# EAGLE design PickupDriverV3.3 (EAGLE 6.1)
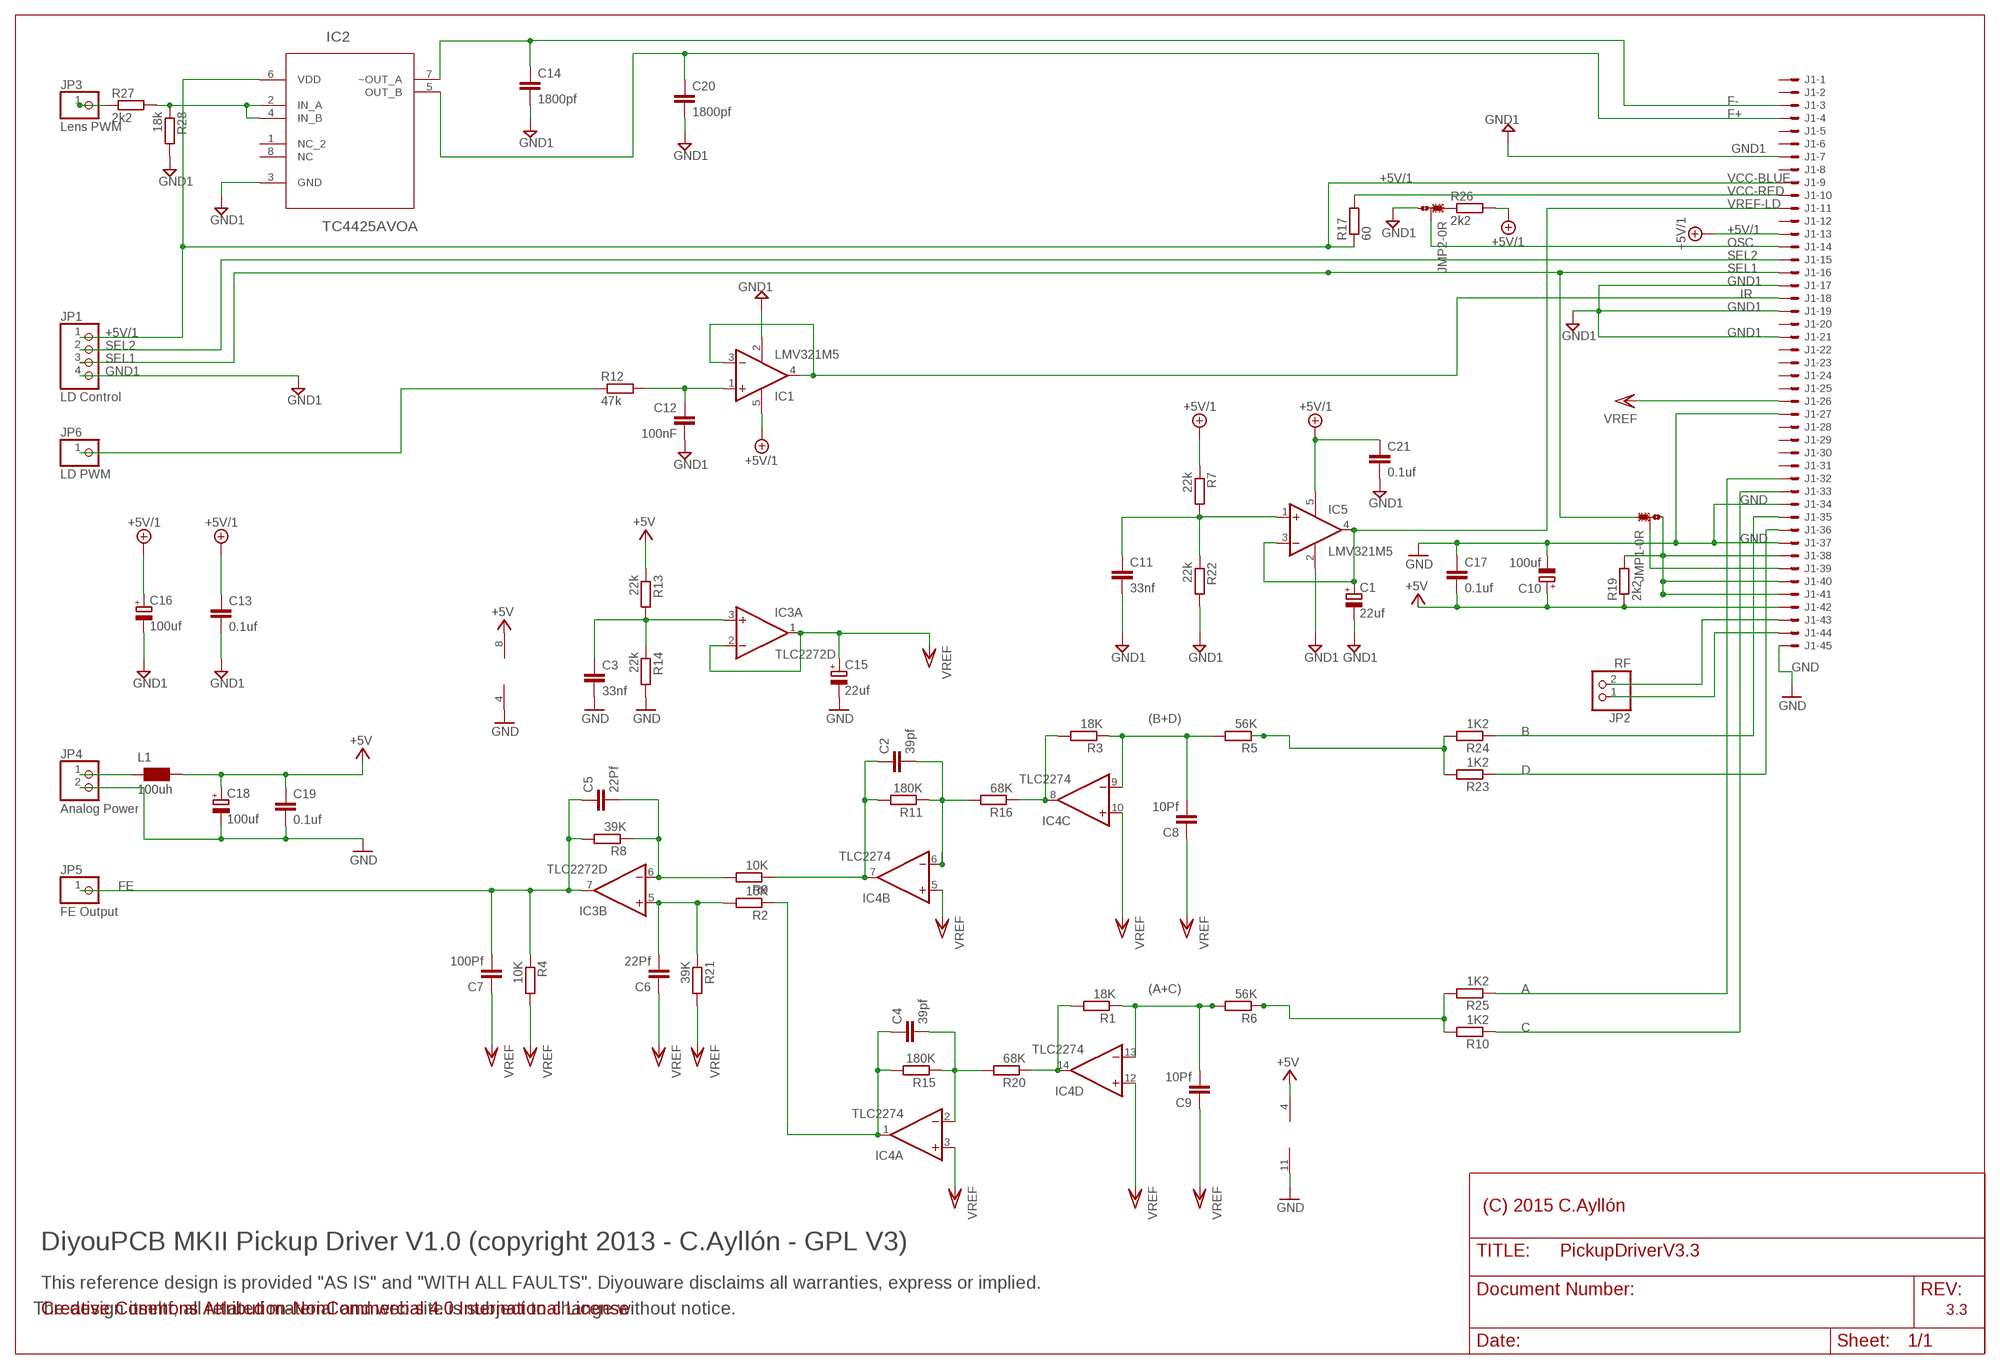
[diagram p0: schematic, sheet 1]

## Parts
C1  22uf  CPOL-EUSMCC  [SMC_C]
C2  39pf  C-EUC1206K  [C1206K]
C3  33nf  C-EUC1206K  [C1206K]
C4  39pf  C-EUC1206K  [C1206K]
C5  22Pf  C-EUC1206K  [C1206K]
C6  22Pf  C-EUC1206K  [C1206K]
C7  100Pf  C-EUC1206K  [C1206K]
C8  10Pf  C-EUC1206K  [C1206K]
C9  10Pf  C-EUC1206K  [C1206K]
C10  100uf  CPOL-EUSMCC  [SMC_C]
C11  33nf  C-EUC1206K  [C1206K]
C12  100nF  C-EUC1206K  [C1206K]
C13  0.1uf  C-EUC1206K  [C1206K]
C14  1800pf  C-EUC1206K  [C1206K]
C15  22uf  CPOL-EUSMCC  [SMC_C]
C16  100uf  CPOL-EUSMCC  [SMC_C]
C17  0.1uf  C-EUC1206K  [C1206K]
C18  100uf  CPOL-EUSMCC  [SMC_C]
C19  0.1uf  C-EUC1206K  [C1206K]
C20  1800pf  C-EUC1206K  [C1206K]
C21  0.1uf  C-EUC1206K  [C1206K]
IC1  LMV321M5  [SOT23-5]
IC2  TC4425AVOA  [SOIC127P600X175-8N]
IC3  TLC2272D  [SO08]
IC4  TLC2274  TLC274D  [SO14]
IC5  LMV321M5  [SOT23-5]
J1  XF2H-4515-1LW  [XF2H-4515-1LW]
JMP1  0R-JUMPA  [A0R-JMP]
JMP2  0R-JUMPA  [A0R-JMP]
JP1  LD Control  PINHD-1X4  [1X04]
JP2  RF  PINHD-1X2  [1X02]
JP3  Lens PWM  PINHD-1X1  [1X01]
JP4  Analog Power  PINHD-1X2  [1X02]
JP5  FE Output  PINHD-1X1  [1X01]
JP6  LD PWM  PINHD-1X1  [1X01]
L1  100uh  CHOKE-100UH  [CHOKE-100UH-1]
R1  18K  R-EU_R1206  [R1206]
R2  10K  R-EU_R1206  [R1206]
R3  18K  R-EU_R1206  [R1206]
R4  10K  R-EU_R1206  [R1206]
R5  56K  R-EU_R1206  [R1206]
R6  56K  R-EU_R1206  [R1206]
R7  22k  R-EU_R1206  [R1206]
R8  39K  R-EU_R1206  [R1206]
R9  10K  R-EU_R1206  [R1206]
R10  1K2  R-EU_R1206  [R1206]
R11  180K  R-EU_R1206  [R1206]
R12  47k  R-EU_R1206  [R1206]
R13  22k  R-EU_R1206  [R1206]
R14  22k  R-EU_R1206  [R1206]
R15  180K  R-EU_R1206  [R1206]
R16  68K  R-EU_R1206  [R1206]
R17  60  R-EU_R1206  [R1206]
R19  2k2  R-EU_R1206  [R1206]
R20  68K  R-EU_R1206  [R1206]
R21  39K  R-EU_R1206  [R1206]
R22  22k  R-EU_R1206  [R1206]
R23  1K2  R-EU_R1206  [R1206]
R24  1K2  R-EU_R1206  [R1206]
R25  1K2  R-EU_R1206  [R1206]
R26  2k2  R-EU_R1206  [R1206]
R27  2k2  R-EU_R1206  [R1206]
R28  18k  R-EU_R1206  [R1206]

## Nets
+5V [supply1]: C10.+ C17.2 C18.+ C19.1 IC3.8(P:V+) IC4.4(P:V+) J1.42 L1.2 R13.1 R19.1
+5V/1 [supply2]: C13.1 C16.+ C21.1 IC1.5(V+) IC2.6(VDD) IC5.5(V+) J1.9 J1.13 JP1.1 R7.1 R17.1 R26.2
A: J1.32 R25.1
B: J1.35 R24.1
C: J1.33 R10.1
D: J1.36 R23.1
F+ [foco]: C20.1 IC2.5(OUT_B) J1.4
F- [foco]: C14.1 IC2.7(~OUT_A) J1.3
FE: C5.1 C7.2 IC3.7(B:OUT) JP5.1 R4.1 R8.2
FOCUS: IC2.2(IN_A) IC2.4(IN_B) R27.2 R28.1
GND [gnd]: C3.2 C10.- C15.- C17.1 C18.- C19.2 IC3.4(P:V-) IC4.11(P:V-) J1.27 J1.34 J1.37 J1.45 JP4.2 R14.2
GND1 [gnd1]: C1.- C11.2 C12.2 C13.2 C14.2 C16.- C20.2 C21.2 IC1.2(V-) IC2.3(GND) IC5.2(V-) J1.7 J1.17 J1.19 J1.21 JMP2.3 JP1.4 R22.2 R28.2
IR: IC1.3(-IN) IC1.4(OUT) J1.18
LASER_CURR: JP6.1 R12.1
LENS: JP3.1 R27.1
N$1: C11.1 IC5.1(+IN) R7.2 R22.1
N$2: C2.1 IC4.7(B:OUT) R9.1 R11.2
N$3: C12.1 IC1.1(+IN) R12.2
N$4: C8.2 IC4.9(C:-IN) R3.1 R5.2
N$5: IC4.14(D:OUT) R1.2 R20.1
N$6: C3.1 IC3.3(A:+IN) R13.2 R14.1
N$7: IC4.8(C:OUT) R3.2 R16.1
N$8: C9.2 IC4.13(D:-IN) R1.1 R6.2
N$9: C2.2 IC4.6(B:-IN) R11.1 R16.2
N$10: C5.2 IC3.6(B:-IN) R8.1 R9.2
N$11: C6.2 IC3.5(B:+IN) R2.2 R21.1
N$12 [supply1]: JP4.1 L1.1
N$13: JMP2.1 R26.1
N$14: C4.1 IC4.1(A:OUT) R2.1 R15.2
N$15: C4.2 IC4.2(A:-IN) R15.1 R20.2
N$16: R6.1 R10.2 R25.2
N$19: J1.43 JP2.2
N$20: J1.44 JP2.1
N$22: R5.1 R23.2 R24.2
ND: J1.38 J1.40 J1.41 JMP1.3 R19.2
OSC: J1.14 JMP2.2
REDVCC [supply2]: J1.10 R17.2
SEL1: J1.16 JMP1.1 JP1.3
SEL2: J1.15 JP1.2
SW: J1.39 JMP1.2
VREF: C6.1 C7.1 C8.1 C9.1 C15.+ IC3.1(A:OUT) IC3.2(A:-IN) IC4.3(A:+IN) IC4.5(B:+IN) IC4.10(C:+IN) IC4.12(D:+IN) J1.26 R4.2 R21.2
VREF-LD: C1.+ IC5.3(-IN) IC5.4(OUT) J1.11
Unconnected: IC2.1(NC_2) IC2.8(NC) J1.1 J1.2 J1.5 J1.6 J1.8 J1.12 J1.20 J1.22 J1.23 J1.24 J1.25 J1.28 J1.29 J1.30 J1.31

## Notes on the sheet
- VCC-BLUE
- VCC-RED
- (B+D)
- (A+C)
- (C) 2015 C.Ayllón
- DiyouPCB MKII Pickup Driver V1.0 (copyright 2013 - C.Ayllón - GPL V3)
- This reference design is provided "AS IS" and "WITH ALL FAULTS". Diyouware disclaims all warranties, express or implied.
- The design itseltf, all related material and web site is subject to change without notice. | Creative Commons Attribution-NonCommercial 4.0 International License | 3.3

## Library data of the parts
C1 C10 C15 C16 C18 = rcl:CPOL-EU: POLARIZED CAPACITOR, European symbol
C2 C4-C9 C12 C14 C20 = rcl:C-EU: CAPACITOR, European symbol
C3 C11 C13 C17 C19 C21 = resistor:C-EU: CAPACITOR, European symbol
IC1 IC5 = linear:LMV321?*: General Purpose, Low Voltage, Rail-to-Rail Output Operational Amplifiers Source: http://www.national.com/mpf/LM/LMV321.html http://www.national.com/dt/lmv_qual.pdf
IC2 = Microchip_By_element14_Batch_1:TC4425AVOA: Dual High-Speed Power MOSFET Drivers; DESCRIPTION: MOSFET; MPN: TC4425AVOA; OC_FARNELL: 1834904; OC_NEWARK: 56K7426; PACKAGE: SOIC-8; SUPPLIER: Microchip
IC3 = linear:TLC2272: OP AMP
IC4 = linear:TLC274: OP AMP
J1 = con-omron:XF2*-45?: OMRON FPC Connector Source : http://www.omron.com/ecb/products/pdf/fpc.pdf; OC_FARNELL: unknown; OC_NEWARK: unknown
JMP1 JMP2 = jump-0r-smd:0R-JUMP: SMD 0R 0805 Jumper
JP1 = pinhead:PINHD-1X4: PIN HEADER
JP2 JP4 = pinhead:PINHD-1X2: PIN HEADER
JP3 JP5 JP6 = pinhead:PINHD-1X1: PIN HEADER
L1 = wurth_electronics_midcom_inc_v1-0:CHOKE-100UH
R1-R17 R19-R28 = rcl:R-EU_: RESISTOR, European symbol

## Net classes
0 default: width 0.254 mm, drill 0.305 mm, clearance 0.127 mm
1 supply1: width 0.381 mm, drill 0.305 mm, clearance 0.127 mm
2 gnd: width 0.381 mm, drill 0.305 mm, clearance 0.127 mm
3 supply2: width 0.432 mm, drill 0.305 mm, clearance 0.127 mm
4 foco: width 0.432 mm, drill 0.305 mm, clearance 0.127 mm
5 gnd1: width 0.381 mm, drill 0.305 mm, clearance 0.127 mm

## Board
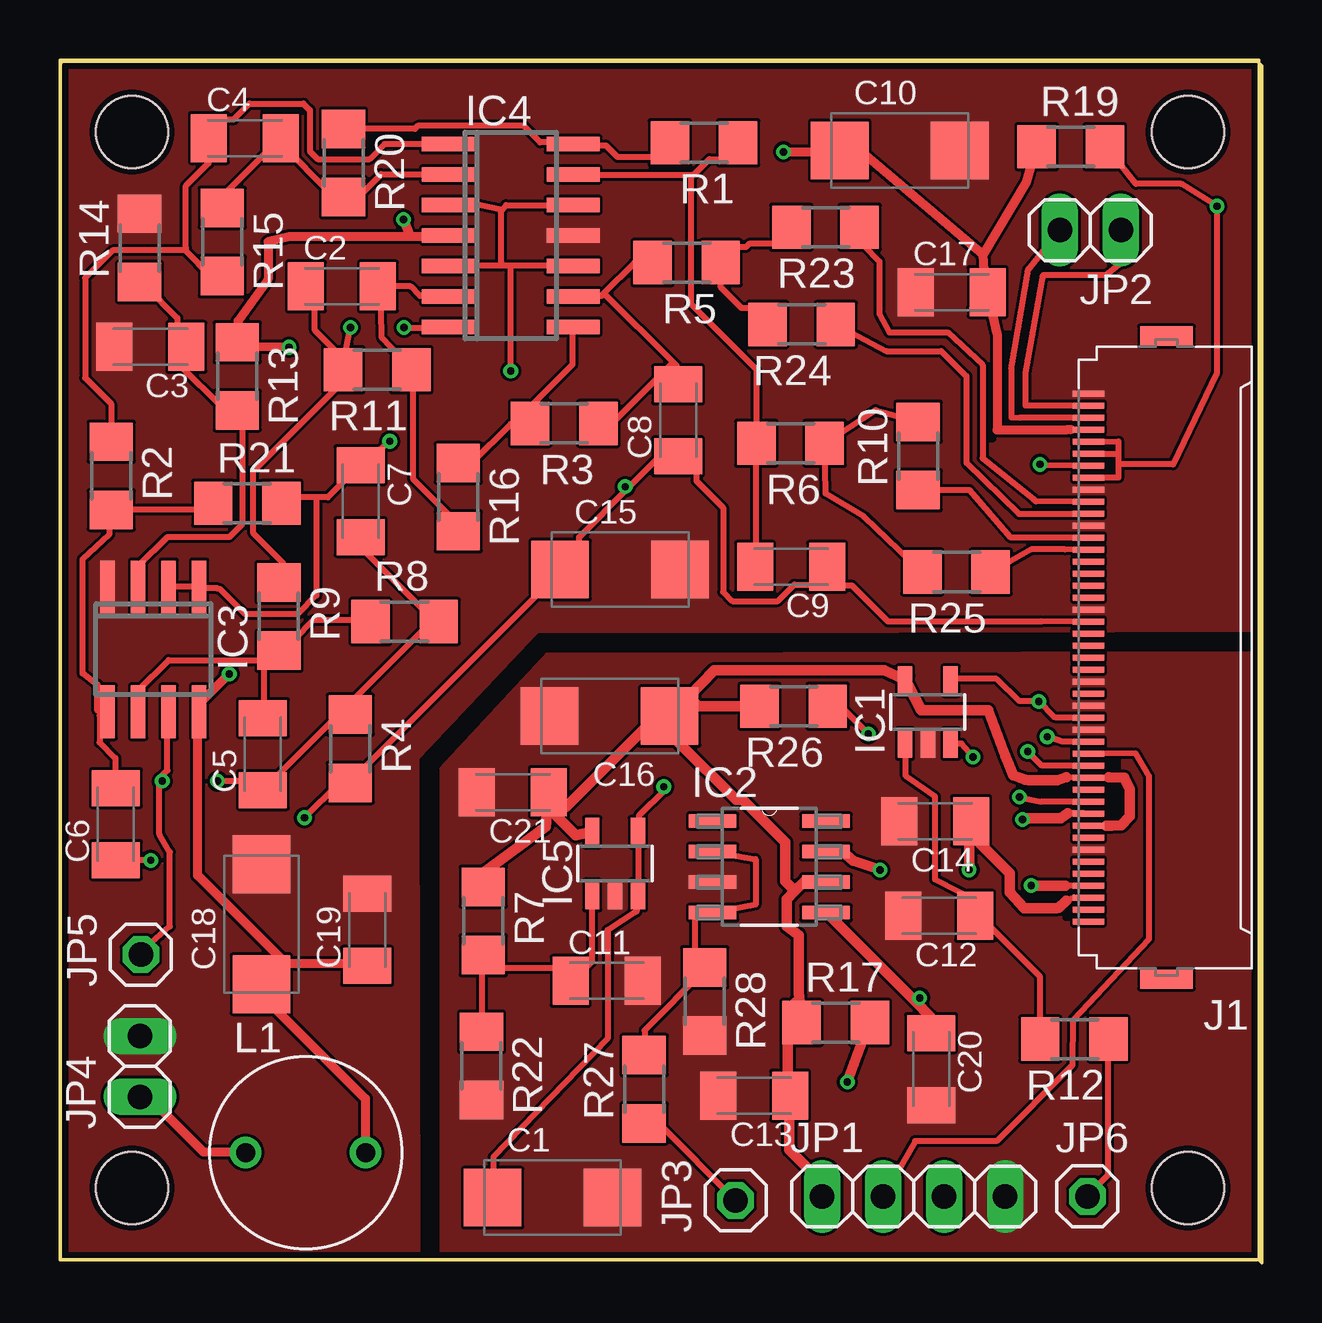
[diagram p1: board, top side]
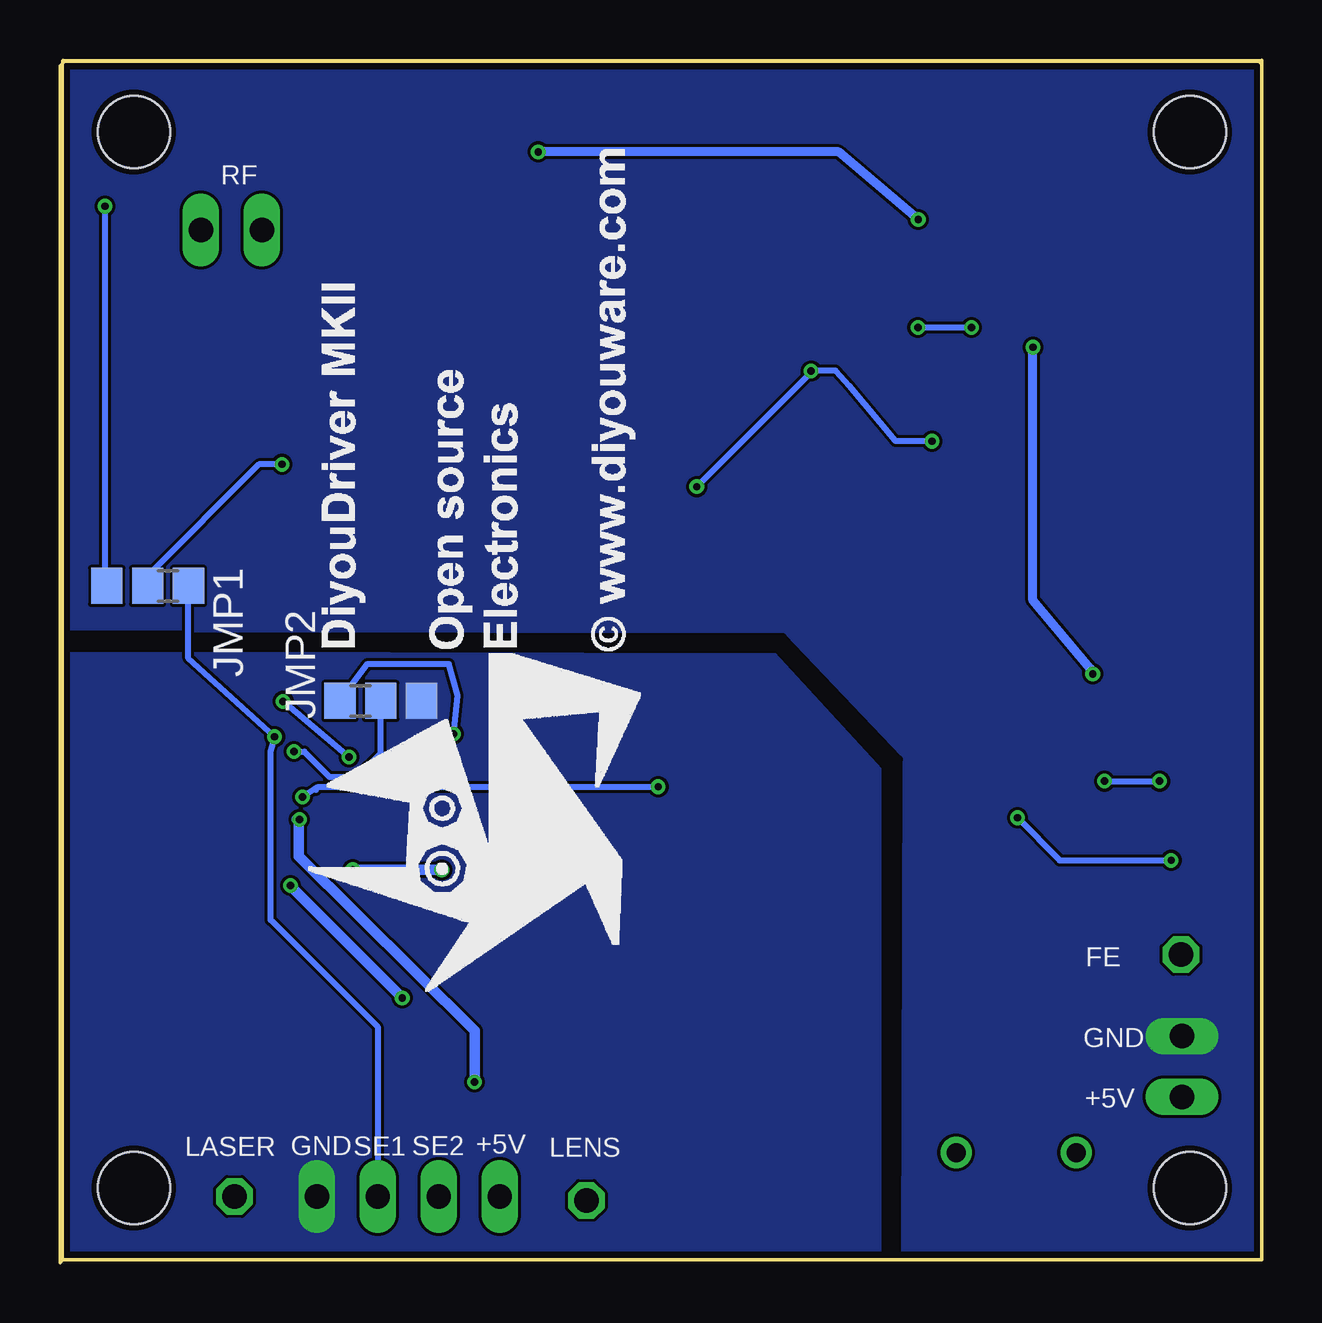
[diagram p2: board, bottom side, seen from below]

Size 50.08 x 50.12 mm. Coordinates in mm from the lower left corner, seen from the top.
Outline: 49.97,0.13 49.96,50.12 0,50.11 0,0.12
Outline: 0,0.12 49.95,0.12
Outline: 0,50.12 0,49.94
Outline: 0,49.94 0,0.12
Outline: 0,0.12 49.96,0.12 50.08,0 50.08,49.87 49.89,50.06 0.12,50.06 0,49.94
Copper layers (1*16): Top 0.035mm / dielectric 1.5mm / Bottom 0.035mm
Design rules "default": minimum track width 5mil, minimum drill 12mil, track to track 5mil, track to pad 5mil, pad to pad 5mil, via to via 5mil, smd to smd 0mil, copper to edge 10mil, drill to drill 10mil, minimum pad ring 10mil, minimum via ring 6mil, stop-mask expansion 2mil, vias tented up to drill 25mil, thermal gap 10mil
Holes 3 mm at 3,47.12 47,47.12 3,3.12 47,3.12
tRestrict: area 15.1,0.1 to 50,26.1; area 43.6,20.5 to 44.1,21; area 38.7,34.3 to 38.9,34.5; area 39.3,37.8 to 39.6,38.7; area 41.9,14.4 to 42.1,14.7
bRestrict: area 15.1,0.1 to 44.4,26.1; area 45,25.6 to 49.7,25.8; area 45,26.1 to 49.7,26.2
vRestrict: area 41.2,13.1 to 42.6,37.7; area 28.4,14.3 to 30.8,18.6; area 21.6,15.8 to 24.6,17.3; area 34.6,22.3 to 37.8,23.6; area 17.6,38.8 to 20.3,47.1; area 1.3,23.9 to 5.8,26.8; area 43.2,14.2 to 49.5,39.9

### Footprints (pad centres in the part's own frame; a part is rotated, then mirrored left to right if it is on the bottom)
SMC_C = smd 2.4 x 2.4: + -2.5,0; - 2.5,0
C1206K = smd 1.5 x 2: 1 -1.5,0; 2 1.5,0
SOT23-5 = smd 0.6 x 1.2: 1 -0.95,-1.306; 2 0,-1.306; 3 0.95,-1.306; 4 0.95,1.306; 5 -0.95,1.306
SOIC127P600X175-8N = smd 1.981 x 0.559: 1 -2.362,1.905; 2 -2.362,0.635; 3 -2.362,-0.635; 4 -2.362,-1.905; 5 2.362,-1.905; 6 2.362,-0.635; 7 2.362,0.635; 8 2.362,1.905
SO08 = smd 0.6 x 2.2: 1 -1.905,-2.6; 2 -0.635,-2.6; 3 0.635,-2.6; 4 1.905,-2.6; 5 1.905,2.6; 6 0.635,2.6; 7 -0.635,2.6; 8 -1.905,2.6
SO14 = smd 0.6 x 2.2: 1 -3.81,-2.6; 2 -2.54,-2.6; 3 -1.27,-2.6; 4 0,-2.6; 5 1.27,-2.6; 6 2.54,-2.6; 7 3.81,-2.6; 8 3.81,2.6; 9 2.54,2.6; 10 1.27,2.6; 11 0,2.6; 12 -1.27,2.6; 13 -2.54,2.6; 14 -3.81,2.6
XF2H-4515-1LW = smd 1.3 x 0.25: 1 3.175,11; 2 3.175,10.5; 3 3.175,10; 4 3.175,9.5; 5 3.175,9; 6 3.175,8.5; 7 3.175,8; 8 3.175,7.5; 9 3.175,7; 10 3.175,6.5; 11 3.175,6; 12 3.175,5.5; 13 3.175,5; 14 3.175,4.5; 15 3.175,4; 16 3.175,3.5; 17 3.175,3; 18 3.175,2.5; 19 3.175,2; 20 3.175,1.5; 21 3.175,1; 22 3.175,0.5; 23 3.175,0; 24 3.175,-0.5; 25 3.175,-1; 26 3.175,-1.5; 27 3.175,-2; 28 3.175,-2.5; 29 3.175,-3; 30 3.175,-3.5; 31 3.175,-4; 32 3.175,-4.5; 33 3.175,-5; 34 3.175,-5.5; 35 3.175,-6; 36 3.175,-6.5; 37 3.175,-7; 38 3.175,-7.5; 39 3.175,-8; 40 3.175,-8.5; 41 3.175,-9; 42 3.175,-9.5; 43 3.175,-10; 44 3.175,-10.5; 45 3.175,-11 | smd 2.2 x 0.8: M1 -0.075,13.4; M2 -0.075,-13.4
A0R-JMP = smd 1.5 x 1.3: 1 0,1.7; 2 0,0; 3 0,-1.7
1X04 = drill 1.016 long: 1 -3.81,0; 2 -1.27,0; 3 1.27,0; 4 3.81,0
1X02 = drill 1.016 long: 1 -1.27,0; 2 1.27,0
1X01 = drill 1.016 octagon: 1 0,0
CHOKE-100UH-1 = drill 0.8: 1 -2.5,0; 2 2.5,0
R1206 = smd 1.6 x 1.803: 1 -1.422,0; 2 1.422,0

### Placement (x,y rotation side)
C1  20.52,2.72 0 top
C2  11.75,40.69 0 top
C3  3.77,38.17 180 top
C4  7.71,46.87 0 top
C5  8.46,21.19 90 top
C6  2.33,18.28 90 top
C7  12.53,31.73 270 top
C8  25.76,35.11 90 top
C9  30.46,29 180 top
C10  34.99,46.35 0 top
C11  22.78,11.75 0 top
C12  36.63,14.45 180 top
C13  28.93,6.97 180 top
C14  36.46,18.4 180 top
C15  23.34,28.88 0 top
C16  22.9,22.78 180 top
C17  37.15,40.45 0 top
C18  8.39,14.11 90 top
C19  12.8,13.87 90 top
C20  36.3,8.08 270 top
C21  18.87,19.61 180 top
IC1  36.16,22.95 0 top
IC2  29.55,16.5 0 top
IC3  3.89,25.56 180 top
IC4  18.78,42.81 270 top
IC5  23.13,16.64 0 top
J1  46.03,25.22 180 top
JMP1  46.43,28.2 270 bottom
JMP2  36.71,23.42 90 bottom
JP1  35.57,2.77 0 top
JP2  42.94,43.03 180 top
JP3  28.15,2.6 90 top
JP4  3.33,8.18 90 top
JP5  3.37,12.84 90 top
JP6  42.81,2.77 0 top
L1  10.24,4.59 0 top
R1  26.84,46.67 180 top
R2  2.14,32.79 270 top
R3  21.01,34.98 180 top
R4  12.09,21.42 270 top
R5  26.11,41.68 180 top
R6  30.43,34.15 180 top
R7  17.63,14.24 270 top
R8  14.36,26.72 0 top
R9  9.12,26.93 270 top
R10  35.76,33.62 90 top
R11  13.22,37.21 180 top
R12  42.27,9.33 180 top
R13  7.38,36.94 270 top
R14  3.32,42.29 90 top
R15  6.76,42.54 270 top
R16  16.59,31.9 270 top
R17  32.33,10.01 0 top
R19  42.11,46.5 0 top
R20  11.81,45.83 270 top
R21  7.81,31.65 0 top
R22  17.56,8.21 270 top
R23  31.9,43.15 180 top
R24  30.9,39.1 180 top
R25  37.35,28.79 180 top
R26  30.57,23.2 180 top
R27  24.34,7.23 90 top
R28  26.86,10.89 270 top

### Tracks (layer width: path | path; a pad name or v marks a point on that pad's centre or on a via)
+5V  (via drill 0.3)
  Top 0.254: 41.94,34.72 42.12,34.72 J1.42
  Top 0.381: 38.07,39.75 38.55,40.44 C17.2 | 38.47,42.01 33.33,46.35 32.52,46.35 C10.+ 32.31,46.29 v30.15,46.29 | 38.47,42.01 38.55,40.62 C17.2 | 38.59,40.41 C17.2 | 38.47,42.01 40.27,45.05 R19.1 | C17.2 39.05,38.72 39.05,34.7 40.86,34.71 40.87,34.71 41.92,34.7 42.09,34.72 42.12,34.72 | 14.57,42.76 15.68,42.76 16.17,42.78 IC4.4 | 14.57,42.76 9.56,42.76 8.67,42.54 8.67,40.98 7.41,39.24 7.41,38.37 R13.1 7.38,38.16 v9.54,38.15 | C19.1 13.35,12.48 9.27,12.48 C18.+ | v14.32,43.48 14.57,42.76 | L1.2 12.72,4.62 12.72,6.84 8.49,11.07 8.49,11.43 C18.+ | v7.05,24.54 5.82,23.31 5.82,22.98 IC3.8 5.73,22.8 5.73,16.14 9.21,12.66 C18.+
  Bottom 0.381: v30.15,46.29 17.64,46.29 v14.32,43.48 | v9.54,38.15 9.54,27.61 7.15,24.76 7.08,24.57 v7.05,24.54
+5V/1
  Top 0.254: 43.69,20.23 J1.13 41.94,20.23 | J1.9 43.59,18.22 43.83,18.22
  Top 0.432: 30.61,15.5 31.03,15.91 31.71,15.87 IC2.6 | 30.61,15.5 30.28,15.16 30.28,14.03 30.78,13.65 30.78,11.28 R17.1 30.66,10.86 30.33,10.53 30.33,6.99 C13.1 30.39,6.75 30.39,4.71 31.74,3.36 31.74,2.79 JP1.1 | 43.69,20.23 44.34,20.22 44.58,19.74 44.58,18.6 44.22,18.23 43.8,18.21 43.59,18.21 43.59,18.22 | 41.94,20.23 41.55,20.11 40.45,20.11 | 40.45,20.11 40.36,20.11 | 40.45,20.11 40.22,20.12 39.73,20.31 39.39,21.12 38.67,23.02 35.88,23.02 35.34,24.06 IC1.5 35.3,24.46 35.15,24.31 34.35,24.68 27.25,24.68 26.19,23.59 | 25.59,21.87 C16.+ | 20.59,18.72 20.25,19.59 C21.1 20.23,18.17 17.64,16.26 17.64,15.69 R7.1 | 20.59,18.72 21.49,17.82 22.17,17.97 IC5.5 | 20.59,18.72 21.12,19.02 24.81,22.71 C16.+ | 30.61,15.5 30.21,15.9 30.21,17.52 28.44,19.29 28.17,19.29 25.74,21.72 C16.+ | 26.19,23.59 C16.+ | R26.2 26.59,23.2 26.19,23.59
A
  Top 0.254: J1.32 41.87,29.73 40.46,29.73 38.81,28.77 | 38.81,28.77 38.75,28.73 | R25.1 38.79,28.8 38.81,28.77
B
  Top 0.254: R24.1 34.43,37.99 36.72,37.99 37.77,36.95 37.77,33.33 39.95,31.21 J1.35
C
  Top 0.254: J1.33 39.62,30.22 37.9,32.2 35.88,32.19 R10.1
D
  Top 0.254: J1.36 40.66,31.72 40.57,31.81 38.44,33.53 38.44,37.41 36.98,38.77 34.56,38.77 34.14,39.54 34.14,41.73 33.48,42.39 33.36,42.39 33.33,42.42 R23.1
F+  (via drill 0.3)
  Top 0.254: J1.4 41.88,15.72
  Top 0.432: v40.47,15.72 | 41.88,15.72 v40.47,15.72 | v40.47,15.72 | 35.64,10.89 31.92,14.61 IC2.5 | 35.64,10.89 36.27,10.26 36.27,9.48 C20.1 | v35.82,11.04 35.79,11.04 35.64,10.89
  Bottom 0.432: v35.82,11.04 40.47,15.69 v40.47,15.72
F-  (via drill 0.3)
  Top 0.254: J1.3 42.26,15.22 41.92,15.09 | 41.52,14.78 41.62,14.8
  Top 0.432: 41.62,14.8 41.92,15.09 | 41.52,14.78 40.17,14.78 39.57,15.45 39.57,16.23 37.89,17.91 37.89,18.39 C14.1 37.89,17.76 v37.88,16.38 | IC2.7 32.64,17.11 33.05,16.75 v34.17,16.37
  Bottom 0.432: v34.17,16.37 37.1,16.37 v37.88,16.38
FE  (via drill 0.3)
  Top 0.254: 3.54,13.17 JP5.1 3.63,13.2 4.58,14.02 4.58,17.11 4.14,17.86 4.14,20.07 v4.26,20.07 4.14,20.19 4.47,20.52 4.47,22.83 IC3.7 | R4.1 | C7.2 12.54,30.21 12.54,29.82 15.54,26.82 R8.2 15.48,26.73 11.7,22.95 R4.1 | C5.1 8.46,19.71 11.61,22.86 R4.1 | 8.34,19.74 C5.1 | v6.56,20.07 8.67,20.07 C5.1
  Bottom 0.254: v6.56,20.07 v4.26,20.07
FOCUS
  Top 0.254: IC2.2 28.98,16.82 28.98,14.93 27.27,14.58 | 27.27,14.58 27.24,14.57 | 27.27,14.58 27.24,14.7 IC2.4 26.49,14.58 26.46,14.55 26.46,12.45 R28.1 26.85,12.18 24.36,9.69 24.36,8.67 R27.2
GND
  pour Top (isolate 0.127, no thermals): 0,0.12 0.01,50.1 49.95,50.11 49.92,26.33 19.91,26.23 14.97,21.02 15.05,0.15
  pour Bottom (isolate 0.127, no thermals): 0,0.12 0.01,50.08 49.96,50.09 49.92,26.33 19.91,26.23 14.97,21.02 15.05,0.15
GND1
  pour Top (isolate 0.127, no thermals): 15.78,0.12 15.81,20.58 20.29,25.42 49.97,25.55 49.99,0.14
  pour Bottom (isolate 0.127, no thermals): 15.79,0.13 15.8,20.58 20.29,25.42 49.97,25.53 49.95,0.12
IR  (via drill 0.3)
  Top 0.254: IC1.4 37.11,24.27 37.16,24.3 37.19,24.33 39.03,24.33 39.99,23.41 40.77,23.41 | J1.18 42.18,22.72 41.5,22.72 41.42,22.74 40.79,23.41 40.77,23.41 | v38.04,21.08 37.56,21.63 IC1.3 | 40.77,23.41 v40.77,23.4 v40.78,23.4
  Bottom 0.254: v38.04,21.08 v40.78,23.4 v40.78,23.38 40.79,23.38
LASER_CURR
  Top 0.254: R12.1 43.68,9.3 43.68,3.66 42.81,2.79 JP6.1
LENS
  Top 0.254: R27.1 24.36,5.79 24.96,5.79 JP3.1
N$1
  Top 0.254: R22.1 17.58,9.63 17.58,12.78 17.61,12.81 R7.2 17.7,12.27 21.72,12.27 C11.1 21.36,11.76 22.17,12.57 22.17,15.3 IC5.1
N$2  (via drill 0.3)
  Top 0.254: R9.1 9.34,28.81 9.27,29.04 9.3,29.07 9.27,29.19 8.04,30.42 8.04,32.97 11.79,36.72 R11.2 | C2.1 10.62,40.68 10.62,38.85 11.73,37.74 11.73,37.32 R11.2 | v14.34,38.97 16.17,38.97 IC4.7 | v12.1,38.97 11.85,37.65 R11.2
  Bottom 0.254: v12.1,38.97 v14.34,38.97
N$3
  Top 0.254: 35.22,21.21 IC1.1 35.25,21.09 35.25,20.28 36.46,19.42 36.46,15.96 38.34,15 38.34,14.55 C12.1 38.37,14.4 40.83,11.94 R12.2
N$4
  Top 0.254: 22.66,40.4 22.56,40.29 21.39,40.29 IC4.9 | 22.66,40.4 23.94,41.67 24.66,41.67 R5.2 | 22.66,40.4 25.55,37.52 | 25.55,37.52 25.71,37.35 25.71,36.72 C8.2 | 25.55,37.52 23.01,34.98 R3.1
N$5
  Top 0.254: R20.1 14.79,47.25 14.91,47.37 19.32,47.37 20.01,46.68 20.55,46.68 20.61,46.62 21.36,46.62 IC4.14 21.51,46.62 22.14,46.62 22.2,46.56 22.74,46.56 23.22,46.08 25.41,46.08 25.41,46.65 R1.2
N$6
  Top 0.254: R14.1 3.57,40.68 4.89,39.36 4.89,37.92 C3.1 4.71,37.7 7.08,35.33 R13.2 7.14,35.22 7.59,34.77 7.59,30.78 7.05,30.24 4.47,30.24 3.27,29.04 IC3.3
N$7
  Top 0.254: R16.1 16.62,33.33 17.16,33.33 18.78,34.95 19.56,34.95 R3.2 18.99,35.07 21.36,37.44 21.36,38.97 IC4.8
N$8
  Top 0.254: C9.2 28.95,29.76 29.01,29.82 R6.2 29.01,34.26 29.01,37.23 26.28,39.96 26.28,45.33 | 26.28,45.33 22.17,45.33 22.14,45.36 IC4.13 | 26.28,45.33 26.4,45.33 27.06,45.99 28.23,45.99 28.26,46.02 28.26,46.65 R1.1
N$9
  Top 0.254: R16.2 16.59,30.51 16.59,30.78 14.7,32.67 14.7,37.11 R11.1 14.58,37.32 13.41,38.54 13.36,40.74 C2.2 13.62,40.68 14.61,40.68 15,40.29 16.17,40.29 IC4.6
N$10
  Top 0.254: R8.1 12.72,26.79 10.56,26.79 9.78,26.01 8.94,26.01 R9.2 | 8.46,22.71 C5.2 8.49,22.83 8.49,25.71 R9.2 | 8.46,25.86 R9.2 | R9.2 8.37,25.11 4.53,25.11 3.27,23.85 3.27,22.98 IC3.6
N$11
  Top 0.254: R21.1 6.51,31.86 6.03,31.38 2.16,31.38 R2.2 2.07,31.26 2.07,30.36 0.94,29.32 0.94,24.56 1.56,24.09 1.56,23.01 IC3.5 1.65,22.8 1.65,21.69 2.31,21.03 2.31,19.8 C6.2
N$12
  Top 0.381: L1.1 7.71,4.62 5.97,4.62 3.69,6.9 3.36,6.9 JP4.1
N$13  (via drill 0.3)
  Top 0.254: R26.1 32.53,23.2 v33.68,22.04
  Bottom 0.254: v33.68,22.04 33.51,23.64 33.87,24.96 37.27,24.96 JMP2.1
N$14
  Top 0.254: IC4.1 13.53,46.62 12.9,45.99 10.74,45.99 10.41,46.32 10.41,48.03 10.14,48.3 7.89,48.3 7.23,47.64 6.24,47.64 6.21,47.61 6.21,46.98 C4.1 6.18,46.74 6.18,45.81 5.25,44.88 5.25,42.3 5.22,42.18 | 5.22,42.18 2.19,42.18 1.05,41.04 1.05,36.87 2.13,35.79 2.13,34.23 R2.1 | 5.22,42.18 6.27,41.13 6.75,41.13 R15.2
N$15
  Top 0.254: IC4.2 13.38,45.36 12.57,44.55 12.57,44.43 12.54,44.4 11.94,44.4 R20.2 11.7,44.46 11.37,44.46 9.15,46.68 C4.2 9.18,46.86 6.78,44.46 6.78,43.98 R15.1
N$16
  Top 0.254: R25.2 33.5,31.08 31.9,32.05 R6.1 33.97,35.53 R10.2
N$19
  Top 0.254: J1.43 42.09,35.22 42.06,35.22 39.99,35.22 39.64,35.23 39.64,36.48 39.64,37.23 40.34,41.38 JP2.2
N$20
  Top 0.254: J1.44 41.92,35.72 40.23,35.72 40.23,37.08 40.97,41.16 43.6,41.17 44.21,41.66 44.21,43.01 44.22,43.05 JP2.1
N$22
  Top 0.254: R24.2 29.49,39.12 29.49,39.75 29.46,39.78 28.41,39.78 27.54,40.65 R5.1 27.54,41.79 27.54,42.3 27.57,42.33 28.59,42.33 28.74,42.48 30.45,42.48 30.48,42.51 R23.2
ND  (via drill 0.3)
  Top 0.254: J1.41 44.1,34.23 44.1,33.72 | J1.40 44.1,33.72 | 44.1,33.72 44.1,33.27 | 44.1,33.27 44.1,32.72 J1.38 | 44.1,33.27 46.38,33.27 48.21,37.11 48.21,40.88 v48.21,44.03 46.71,44.95 44.83,44.95 43.61,46.49 | 43.61,46.49 43.59,46.51 | R19.2 43.62,46.5 43.61,46.49
  Bottom 0.254: v48.21,44.03 48.21,28.2 | 48.21,28.2 | JMP1.3 48.21,28.2
OSC  (via drill 0.3)
  Top 0.254: J1.14 40.91,20.72 v40.33,21.31
  Bottom 0.254: JMP2.2 36.72,23.4 36.72,21.24 37.71,20.25 38.85,20.25 39.9,21.3 v40.32,21.3 v40.33,21.31
REDVCC  (via drill 0.3)
  Top 0.254: J1.10 42.66,18.73 42,18.73
  Top 0.432: 40.09,18.49 v40.1,18.47 v40.11,18.48 40.32,18.51 40.32,18.52 41.71,18.52 42,18.73 | v32.81,7.54 33.72,10.02 R17.2
  Bottom 0.432: 40.22,18.49 v40.1,18.47 | v40.1,18.47 | v32.81,7.54 32.81,9.66 40.13,16.94 40.13,18.48 | 40.13,18.48 40.13,18.54 | v40.1,18.47 v40.11,18.48 40.13,18.48
SEL1  (via drill 0.3)
  Top 0.254: J1.16 41.75,21.72 v41.13,21.92
  Bottom 0.254: JMP1.1 44.73,25.19 v41.13,21.92 41.31,21.3 41.31,14.28 41.22,14.22 36.84,9.84 36.84,2.79 JP1.3
SEL2
  Top 0.254: J1.15 43.07,21.22 44.82,21.23 45.38,20.28 45.38,13.5 42.22,10.13 42.19,8.25 42.12,8.16 39.03,5.07 35.63,5.07 34.32,2.79 JP1.2
SW  (via drill 0.3)
  Top 0.254: J1.39 40.83,33.23 | 40.83,33.23 40.82,33.24 | v40.83,33.27 40.83,33.23
  Bottom 0.254: v40.83,33.27 41.79,33.27 46.41,28.65 46.41,28.23 JMP1.2
VREF  (via drill 0.3)
  Top 0.254: J1.26 40.89,26.73 34.5,26.73 33,28.23 31.98,28.23 31.95,28.26 31.95,28.98 C9.1 31.83,28.26 30.6,28.26 29.91,27.57 28.02,27.57 27.63,27.96 27.63,31.47 26.52,32.58 26.52,33.57 26.49,33.6 25.86,33.6 C8.1 25.74,33.6 24.99,33.6 23.66,32.27 | 23.66,32.27 21.63,30.24 21.63,28.92 21.6,28.89 C15.+ 20.82,28.77 12.15,20.1 R4.2 11.97,19.98 11.64,19.98 v10.18,18.55 | 18.78,41.55 21.36,41.55 IC4.10 | 18.78,41.55 18.39,41.55 | 18.39,41.55 16.2,41.55 IC4.5 | 18.39,43.88 17.49,44.07 16.2,44.07 IC4.3 | 18.39,41.55 18.39,41.67 | 18.39,41.67 18.39,43.88 | IC4.12 21.36,44.07 18.59,44.07 18.36,43.81 18.39,43.88 | 10.68,31.89 11.16,31.89 12.51,33.24 C7.1 12.63,33.3 v13.74,34.23 | 10.68,31.89 9.39,31.89 R21.2 | 10.68,31.89 10.68,27.81 9.9,27.03 7.71,27.03 6.66,28.08 6.54,28.11 5.91,28.11 IC3.1 IC3.2 | v18.78,37.17 18.78,41.55 | v3.78,16.77 C6.1 | 18.39,41.67 | 18.39,41.67 18.39,41.55 | v23.55,32.34 23.58,32.34 23.66,32.27
  Bottom 0.254: v13.74,34.23 15.27,34.23 17.2,36.55 17.77,37.18 v18.78,37.17 18.84,37.05 v23.55,32.34 | v3.78,16.77 8.43,16.77 v10.18,18.55
VREF-LD  (via drill 0.3)
  Top 0.254: J1.11 40.89,19.22 v39.98,19.41 | 25.11,19.8 v25.14,19.83 v25.15,19.84 25.23,19.74 24.12,18.63 24.12,18.06 IC5.4 IC5.3 24.03,15.21 24.03,14.64 22.82,13.86 22.82,9.35 18.05,4.4 C1.+
  Bottom 0.254: 39.37,19.81 39.45,19.76 | 39.45,19.76 v39.98,19.41 | v25.15,19.84 25.12,19.81 39.33,19.82 39.36,19.82 39.42,19.71 39.45,19.76

### Text on the board
bPlace: RF | FE | GND | +5V | LENS | +5V | SE2 | SE1 | GND | LASER